# Altium schematic sheet SEN0373_Schematic.SchDoc
size A
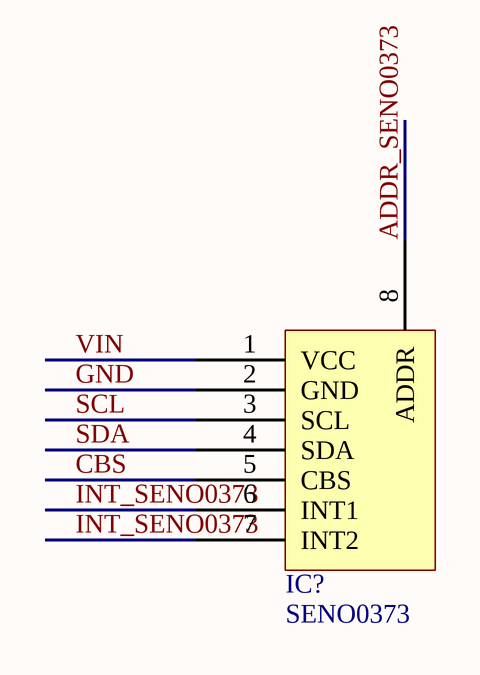
[diagram p0: SEN0373_Schematic.SchDoc]

## Parts
IC?  SENO0373

## Nets
ADDR_SENO0373: IC?.8(ADDR)
CBS: IC?.5(CBS)
GND: IC?.2(GND)
INT_SENO0373: IC?.6(INT1) IC?.7(INT2)
SCL: IC?.3(SCL)
SDA: IC?.4(SDA)
VIN: IC?.1(VCC)